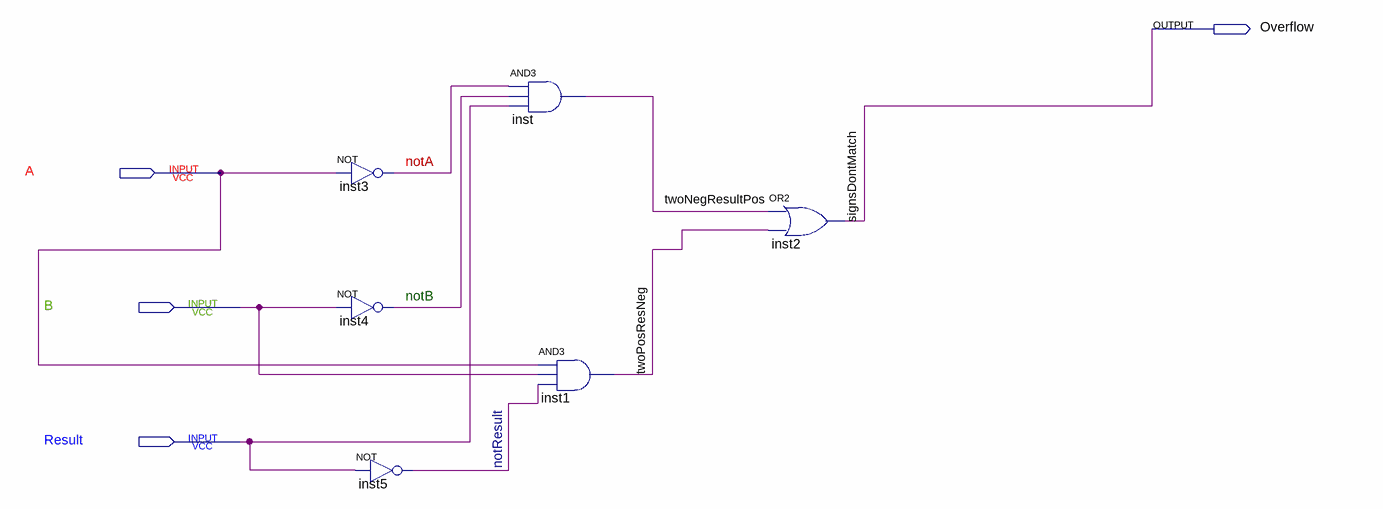
[diagram p0: schematic sheet]
// Quartus schematic OverflowDetection.bdf as structural Verilog: 6 symbols, 4 pins
module OverflowDetection (
  input  A,
  input  B,
  input  Result,
  output Overflow
);

  wire notA, notB, notResult, twoNegResultPos, twoPosResNeg;

  not inst3 (notA, A);
  not inst4 (notB, B);
  not inst5 (notResult, Result);
  and inst (twoNegResultPos, notA, notB, Result);
  and inst1 (twoPosResNeg, A, B, notResult);
  or inst2 (Overflow, twoNegResultPos, twoPosResNeg);

  // Other names for the same wires on the sheet: signsDontMatch = Overflow
endmodule
